# Altium schematic sheet output_stage.SchDoc
size 431 x 279 mm; Author: Pawel Bukowiec; Organization: ORGANIZATION; Address1: ADDRESS 1; Address2: ADDRESS 2; Address3: ADDRESS 3; Address4: ADDRESS 4; Revision: 1; SheetNumber: 5; SheetTotal: 5; ENG_APP_DATE: --/--/--; DSN_APP_DATE: --/--/--; CHK_APP_DATE: --/--/--; SPICEModelCacheNCNDFIAY: <root> / <DocumentId>NCNDFIAY</DocumentId> / <CacheFrame Number="0"> / <Model Name="irfz24n" Kind="CKT"> / <Text>.SUBCKT irfz24n 1 2 3 / ************************************** / *      Model Generated by MODPEX     * / *Copyright(c) Symmetry Design Systems* / *         All Rights Reserved        * / *    UNPUBLISHED LICENSED SOFTWARE   * / *   Contains Proprietary Information * / *      Which is The Property of      * / *     SYMMETRY OR ITS LICENSORS      * / *Commercial Use or Resale Restricted * / *   by Symmetry License Agreement    * / ************************************** / * Model generated on Apr 24, 96 / * Model format: SPICE3 / * Symmetry POWER MOS Model (Version 1.0) / * External Node Designations / * Node 1 -&gt; Drain / * Node 2 -&gt; Gate / * Node 3 -&gt; Source / M1 9 7 8 8 MM L=100u W=100u / * Default values used in MM: / * The voltage-dependent capacitances are / * not included. Other default values are: / *   RS=0 RD=0 LD=0 CBD=0 CBS=0 CGBO=0 / .MODEL MM NMOS LEVEL=1 IS=1e-32 / +VTO=3.6319 LAMBDA=0 KP=8.99346 / +CGSO=3.09714e-06 CGDO=1.6185e-07 / RS 8 3 0.0409355 / D1 3 1 MD / .MODEL MD D IS=1.43387e-10 RS=0.0112766 N=1.28803 BV=55 / +IBV=0.00025 EG=1.2 XTI=2.96465 TT=0 / +CJO=2.96476e-10 VJ=0.50803 M=0.3 FC=0.5 / RDS 3 1 2.2e+06 / RD 9 1 0.0001 / RG 2 7 2.4575 / D2 4 5 MD1 / * Default values used in MD1: / *   RS=0 EG=1.11 XTI=3.0 TT=0 / *   BV=infinite IBV=1mA / .MODEL MD1 D IS=1e-32 N=50 / +CJO=4.37817e-10 VJ=0.5 M=0.578699 FC=1e-08 / D3 0 5 MD2 / * Default values used in MD2: / *   EG=1.11 XTI=3.0 TT=0 CJO=0 / *   BV=infinite IBV=1mA / .MODEL MD2 D IS=1e-10 N=0.4 RS=3e-06 / RL 5 10 1 / FI2 7 9 VFI2 -1 / VFI2 4 0 0 / EV16 10 0 9 7 1 / CAP 11 10 6.81971e-10 / FI1 7 9 VFI1 -1 / VFI1 11 6 0 / RCAP 6 10 1 / D4 0 6 MD3 / * Default values used in MD3: / *   EG=1.11 XTI=3.0 TT=0 CJO=0 / *   RS=0 BV=infinite IBV=1mA / .MODEL MD3 D IS=1e-10 N=0.4 / .ENDS</Text> / </Model> / <Model Name="and2_basic_gen" Kind="CKT"> / <Text>*$ / .SUBCKT AND2_BASIC_GEN A B Y PARAMS: VDD=1 VSS=0 VTHRESH=0.5 / E_ABMGATE    YINT 0 VALUE {{IF(V(A) &gt; {VTHRESH}  &amp; / + V(B) &gt; {VTHRESH},{VDD},{VSS})}} / RINT YINT Y 1 / CINT Y 0 1n / .ENDS AND2_BASIC_GEN</Text> / </Model> / <Model Name="comphys_basic_gen" Kind="CKT"> / <Text>*$ / .SUBCKT COMPHYS_BASIC_GEN INP INM HYS OUT PARAMS: VDD=1 VSS=0 VTHRESH=0.5 / EIN INP1 INM1 INP INM 1 / EHYS INP1 INP2 VALUE { IF( V(1) &gt; {VTHRESH},-V(HYS),0) } / EOUT OUT 0 VALUE { IF( V(INP2)&gt;V(INM1), {VDD} ,{VSS}) } / R1 OUT 1 1 / C1 1 0 5.0n / RINP1 INP1 0 1K / .ENDS COMPHYS_BASIC_GEN</Text> / </Model> / <Model Name="nmos01" Kind="MDL"> / <Text>*$ / ** Wrapper definitions for AA legacy support ** / ****************************** / .model NMOS01 nmos / + vto=2 / + kp=0.55 / + lambda=0.001</Text> / </Model> / <Model Name="buf_basic_gen" Kind="CKT"> / <Text>*$ / .SUBCKT BUF_BASIC_GEN A  Y PARAMS: VDD=1 VSS=0 VTHRESH=0.5 / E_ABMGATE    YINT 0 VALUE {{IF(V(A) &gt; {VTHRESH} , / + {VDD},{VSS})}} / RINT YINT Y 1 / CINT Y 0 1n / .ENDS BUF_BASIC_GEN</Text> / </Model> / <Model Name="falling_delay" Kind="CKT"> / <Text>****************************** / *$ / .subckt falling_delay in out params: delay=100n vdd=1 vss=0 vthresh=0.5 / x_u1         int out buf_basic_gen params: vdd={vdd} vss={vss} vthresh= / + {vthresh} / r_r1         in int  {delay/(0.693 * 1e-9)} / c_c1         0 int  1n / d_d1         in int dd / .model dd d / + is=1e-015 / + n=1 / + tt=1e-011 / .ends falling_delay</Text> / <Dependency>0\buf_basic_gen</Dependency> / </Model> / <Model Name="nsw_ps" Kind="CKT"> / <Text>*$ / .SUBCKT NSW_PS D G S PARAMS: RONval=10k VTHval=0.7 VCHARval=0.01 CGval=0.01pF CDval=0.01pF CSval=0.01pf / RDDUM D 0 1e11 / RSDUM S 0 1e11 / RGDUM G 0 1e11 / CG G D {CGval} / CD D S {CDval} / CS G S {CSval} / ***EEXP F1 0 VALUE={LIMIT(((V(G,S)-VTHval)/VCHARval),-80,80)} / Etest test 0 VALUE={IF(V(D) &gt; V(S), V(G,S), V(G,D))} / GOUT D S VALUE={V(D,S)/(RONval*(1+EXP(-LIMIT(((V(test)-VTHval)/VCHARval),-80,80))))} / .ENDS NSW_PS</Text> / </Model> / <Model Name="psw_ps" Kind="CKT"> / <Text>*$ / .SUBCKT PSW_PS D G S PARAMS: RONval=10k VTHval=0.7 VCHARval=0.01 CGval=0.01pF CDval=0.01pF / RDDUM D 0 1e11 / RSDUM S 0 1e11 / RGDUM G 0 1e11 / CG G D {CGval} / CD D S {CDval} / Etest test 0 VALUE={IF(V(S) &gt; V(D), V(S,G), V(D,G))} / GOUT S D VALUE={V(S,D)/(RONval*(1+EXP(-LIMIT(((V(test)-VTHval)/VCHARval),-80,80))))} / .ENDS PSW_PS</Text> / </Model> / <Model Name="buffer_ps" Kind="CKT"> / <Text>*$ / .SUBCKT BUFFER_PS A Y PARAMS: vhi=1 vlo=0 vthresh=500e-3 tplh=1e-9 tphl=1e-9 tr=1e-9 tf=1e-9 / RA A 0 1e11 / CA A 0 0.01pF / VS VSUP 0 DC 1 / EBUF1 Ypp 0 VALUE={IF(V(A) &gt; ({vthresh}), 1, 0)} / ROUTpp Ypp 0 1e11 / XNSW1 OUTp Ypp 0 NSW_PS PARAMS: RONval={(tplh+1e-15)/(1e-12*0.693)} VTHval=0.5 / XPSW1 OUTp Ypp VSUP PSW_PS PARAMS: RONval={(tphl+1e-15)/(1e-12*0.693)} VTHval=0.5 / CDEL1 OUTp 0 1pF / ETHRESH Yp 0 VALUE={IF(V(OUTp) &gt; 0.5, 1, 0)} / ROUTp Yp 0 1e11 / XNSW2 OUTr Yp 0 NSW_PS PARAMS: RONval={(tf+1e-15)/(1e-12*2.3)} VTHval=0.5 / XPSW2 OUTr Yp VSUP PSW_PS PARAMS: RONval={(tr+1e-15)/(1e-12*2.3)} VTHval=0.5 / CDEL2 OUTr 0 1pF / EOUT OUTf 0 VALUE={V(OUTr)*({vhi} - {vlo})+{vlo}} / RDR OUTf Y  1000 / RO Y 0 1e11 / .ENDS BUFFER_PS</Text> / <Dependency>0\nsw_ps</Dependency> / <Dependency>0\psw_ps</Dependency> / </Model> / <Model Name="pmos01" Kind="MDL"> / <Text>*$ / ****************************** / .model PMOS01 pmos / + vto=-2 / + kp=0.772 / + lambda=0.001</Text> / </Model> / <Model Name="d_d1" Kind="CKT"> / <Text>*$ / ****************************** / .subckt d_d1 1 2 / d1 1 2 dd1 / .model dd1 d / + is=1e-015 / + tt=1e-011 / + rs=0.05 / + n=1 / .ends d_d1</Text> / </Model> / <Model Name="and3_basic_gen" Kind="CKT"> / <Text>*$ / .SUBCKT AND3_BASIC_GEN A B C Y PARAMS: VDD=1 VSS=0 VTHRESH=0.5 / E_ABMGATE    YINT 0 VALUE {{IF(V(A) &gt; {VTHRESH}  &amp; / + V(B) &gt; {VTHRESH} &amp; / + V(C) &gt; {VTHRESH},{VDD},{VSS})}} / RINT YINT Y 1 / CINT Y 0 1n / .ENDS AND3_BASIC_GEN</Text> / </Model> / <Model Name="nand2_basic_gen" Kind="CKT"> / <Text>*$ / .SUBCKT NAND2_BASIC_GEN A B Y PARAMS: VDD=1 VSS=0 VTHRESH=0.5 / E_ABMGATE    YINT 0 VALUE {{IF(V(A) &gt; {VTHRESH}  &amp; / + V(B) &gt; {VTHRESH},{VSS},{VDD})}} / RINT YINT Y 1 / CINT Y 0 1n / .ENDS NAND2_BASIC_GEN</Text> / </Model> / <Model Name="ucc27282" Kind="CKT"> / <Text>* * source UCC27282 / ***************************************************************************** / * (C) Copyright 2018 Texas Instruments Incorporated. All rights reserved. / ***************************************************************************** / ** This model is designed as an aid for customers of Texas Instruments. / ** TI and its licensors and suppliers make no warranties, either expressed / ** or implied, with respect to this model, including the warranties of / ** merchantability or fitness for a particular purpose. The model is / ** provided solely on an "as is" basis. The entire risk as to its quality / ** and performance is with the customer. / ***************************************************************************** / * / * Released by: WEBENCH Design Center, Texas Instruments Inc. / * Part: UCC27282 / * Date: 10/31/2018 / * Model Type: Transient / * Simulator: PSPICE / * Simulator Version: 16.2 / * EVM Order Number: / * EVM Users Guide: SLUUBM2 / * Datasheet: SNVSAQ5 / * Model Version: Final 1.0 / * Release to Web. / **************************************************************** / *$ / .SUBCKT UCC27282 LI HI EN VDD VSS HB  HO HS  LO / E_U1_E2         HO U1_N16706734 VALUE { IF(V(U1_N16706930, 0) &gt; 0.5, -5, 5) } / R_U1_R9         U1_N16707490 U1_N16707354  50 / V_U1_V10         U1_N16706152 0 0.5 / X_U1_U15         EN U1_N16711349 U1_N16711355 U1_N16713299 COMPHYS_BASIC_GEN / +  PARAMS: VDD=1 VSS=0 VTHRESH=0.5 / E_U1_E6         U1_HI_ON VSS U1_N16708422 VSS 1 / E_U1_E1         U1_N16707534 U1_HOH VALUE { IF(V(U1_HI_ON, 0) &gt; 0.5, 5, -5) } / X_U1_U16         U1_N16712773 U1_N16713299 U1_N16707820 AND2_BASIC_GEN PARAMS: / +  VDD=1 VSS=0 VTHRESH=.5 / X_U1_U4         U1_N16706536 U1_UVLOHI U1_N16708416 AND2_BASIC_GEN PARAMS: / +  VDD=1 VSS=0 VTHRESH=.5 / C_U1_C6         HO U1_N16706748  7.5p / X_U1_U5         HI U1_N16706446 U1_N16706474 U1_N16706240 COMPHYS_BASIC_GEN / +  PARAMS: VDD=1 VSS=0 VTHRESH=0.5 / E_U1_E7         U1_N16708078 VSS HB HS 1 / M_U1_M1         U1_N16707574 U1_N16707548 U1_HOH U1_HOH NMOS01 / C_U1_C7         U1_N16707366 U1_N16707354  12.5p / R_U1_R11         U1_HOH HO  1m / X_U1_U7         U1_HI_ON U1_N16706930 falling_delay PARAMS:  DELAY=1n VDD=1 / +  VSS=0 VTHRESH=0.5 / R_U1_R10         U1_N16707366 VSS  0.02 / V_U1_V3         U1_N16706446 VSS 2.1 / C_U1_C1         U1_N16707548 U1_N16707574  20p / E_U1_E5         U1_LO_ON VSS U1_N16708190 VSS 1 / X_U1_U11         U1_N16708416 U1_N16708422 BUFFER_PS PARAMS: VHI=1 VLO=0 / +  VTHRESH=500E-3 TPLH={Thplh} TPHL={Thphl} TR=1E-9 TF=1E-9 / X_U1_U6         VDD HB d_d1 PARAMS: / ***X_U1_U6         0 0  d_d1 PARAMS: / V_U1_V4         U1_N16706474 0 1 / C_U1_C3         U1_HOH U1_N16707548  5p / C_U1_C8         LO U1_N16707354  7.5p / R_U1_R4         HB U1_N16707574  0.02 / X_U1_U17         U1_N16706240 U1_LOCK U1_N16707820 U1_UVLOHI AND3_BASIC_GEN / +  PARAMS: VDD=1 VSS=0 VTHRESH=500E-3 / X_U1_U12         U1_UVLOLOW U1_N16708190 BUFFER_PS PARAMS: VHI=1 VLO=0 / +  VTHRESH=500E-3 TPLH={Tlplh} TPHL={Tlphl} TR=1E-9 TF=1E-9 / E_U1_E4         U1_N16707138 U1_LOH VALUE { IF(V(U1_LO_ON, 0) &gt; 0.5, 5, -5) } / R_U1_R7         U1_N16707138 U1_N16707192  50 / R_U1_R12         U1_LOH LO  1m / M_U1_M4         U1_N16707366 U1_N16707354 LO LO PMOS01 / M_U1_M2         U1_N16706782 U1_N16706748 HO HO PMOS01 / R_U1_R2         VSS HI  250k / V_U1_V11         U1_N16711349 VSS 1.8 / R_U1_R5         U1_N16706734 U1_N16706748  50 / X_U1_U13         HB U1_N16708226 U1_N16708274 U1_N16706536 COMPHYS_BASIC_GEN / +  PARAMS: VDD=1 VSS=0 VTHRESH=0.5 / M_U1_M3         U1_N16707204 U1_N16707192 U1_LOH U1_LOH NMOS01 / V_U1_V1         U1_N16706306 VSS 2.1 / X_U1_U9         U1_N16708078 U1_N16707998 U1_N16708046 N16718557 / +  COMPHYS_BASIC_GEN PARAMS: VDD=1 VSS=0 VTHRESH=0.5 / X_U1_U8         U1_LO_ON U1_N16707522 falling_delay PARAMS:  DELAY=1n VDD=1 / +  VSS=0 VTHRESH=0.5 / V_U1_V12         U1_N16711355 0 0.4 / C_U1_C4         U1_N16707192 U1_N16707204  20p / V_U1_V7         U1_N16708226 0 3.7 / E_U1_E3         LO U1_N16707490 VALUE { IF(V(U1_N16707522, 0) &gt; 0.5, -5, 5) } / C_U1_C2         U1_N16706782 U1_N16706748  12.5p / X_U1_U14         VDD U1_N16706124 U1_N16706152 U1_N16712773 COMPHYS_BASIC_GEN / +  PARAMS: VDD=1 VSS=0 VTHRESH=0.5 / V_U1_V2         U1_N16706332 0 1 / V_U1_V5         U1_N16707998 0 3.55 / C_U1_C5         U1_LOH U1_N16707192  5p / R_U1_R13         VSS EN  200k / V_U1_V8         U1_N16708274 0 0.4 / R_U1_R6         U1_N16706782 HS  0.02 / X_U1_U10         LI U1_N16706306 U1_N16706332 U1_N16706526 COMPHYS_BASIC_GEN / +  PARAMS: VDD=1 VSS=0 VTHRESH=0.5 / X_U1_U20         HI LI U1_LOCK NAND2_BASIC_GEN PARAMS: VDD=1 VSS=0 / +  VTHRESH=500E-3 / R_U1_R8         VDD U1_N16707204  0.02 / V_U1_V6         U1_N16708046 0 0.1 / R_U1_R1         VSS LI  250k / V_U1_V9         U1_N16706124 VSS 5 / R_U1_R3         U1_N16707534 U1_N16707548  50 / X_U1_U18         U1_N16707820 U1_LOCK U1_N16706526 U1_UVLOLOW AND3_BASIC_GEN / +  PARAMS: VDD=1 VSS=0 VTHRESH=500E-3 / .PARAM  thplh=10n tlphl=8.2n thphl=8n tlplh=10.5n / .ends UCC27282</Text> / <Dependency>0\and2_basic_gen</Dependency> / <Dependency>0\comphys_basic_gen</Dependency> / <Dependency>0\nmos01</Dependency> / <Dependency>0\falling_delay</Dependency> / <Dependency>0\buffer_ps</Dependency> / <Dependency>0\pmos01</Dependency> / <Dependency>0\d_d1</Dependency> / <Dependency>0\and3_basic_gen</Dependency> / <Dependency>0\nand2_basic_gen</Dependency> / </Model> / </CacheFrame> / </root>
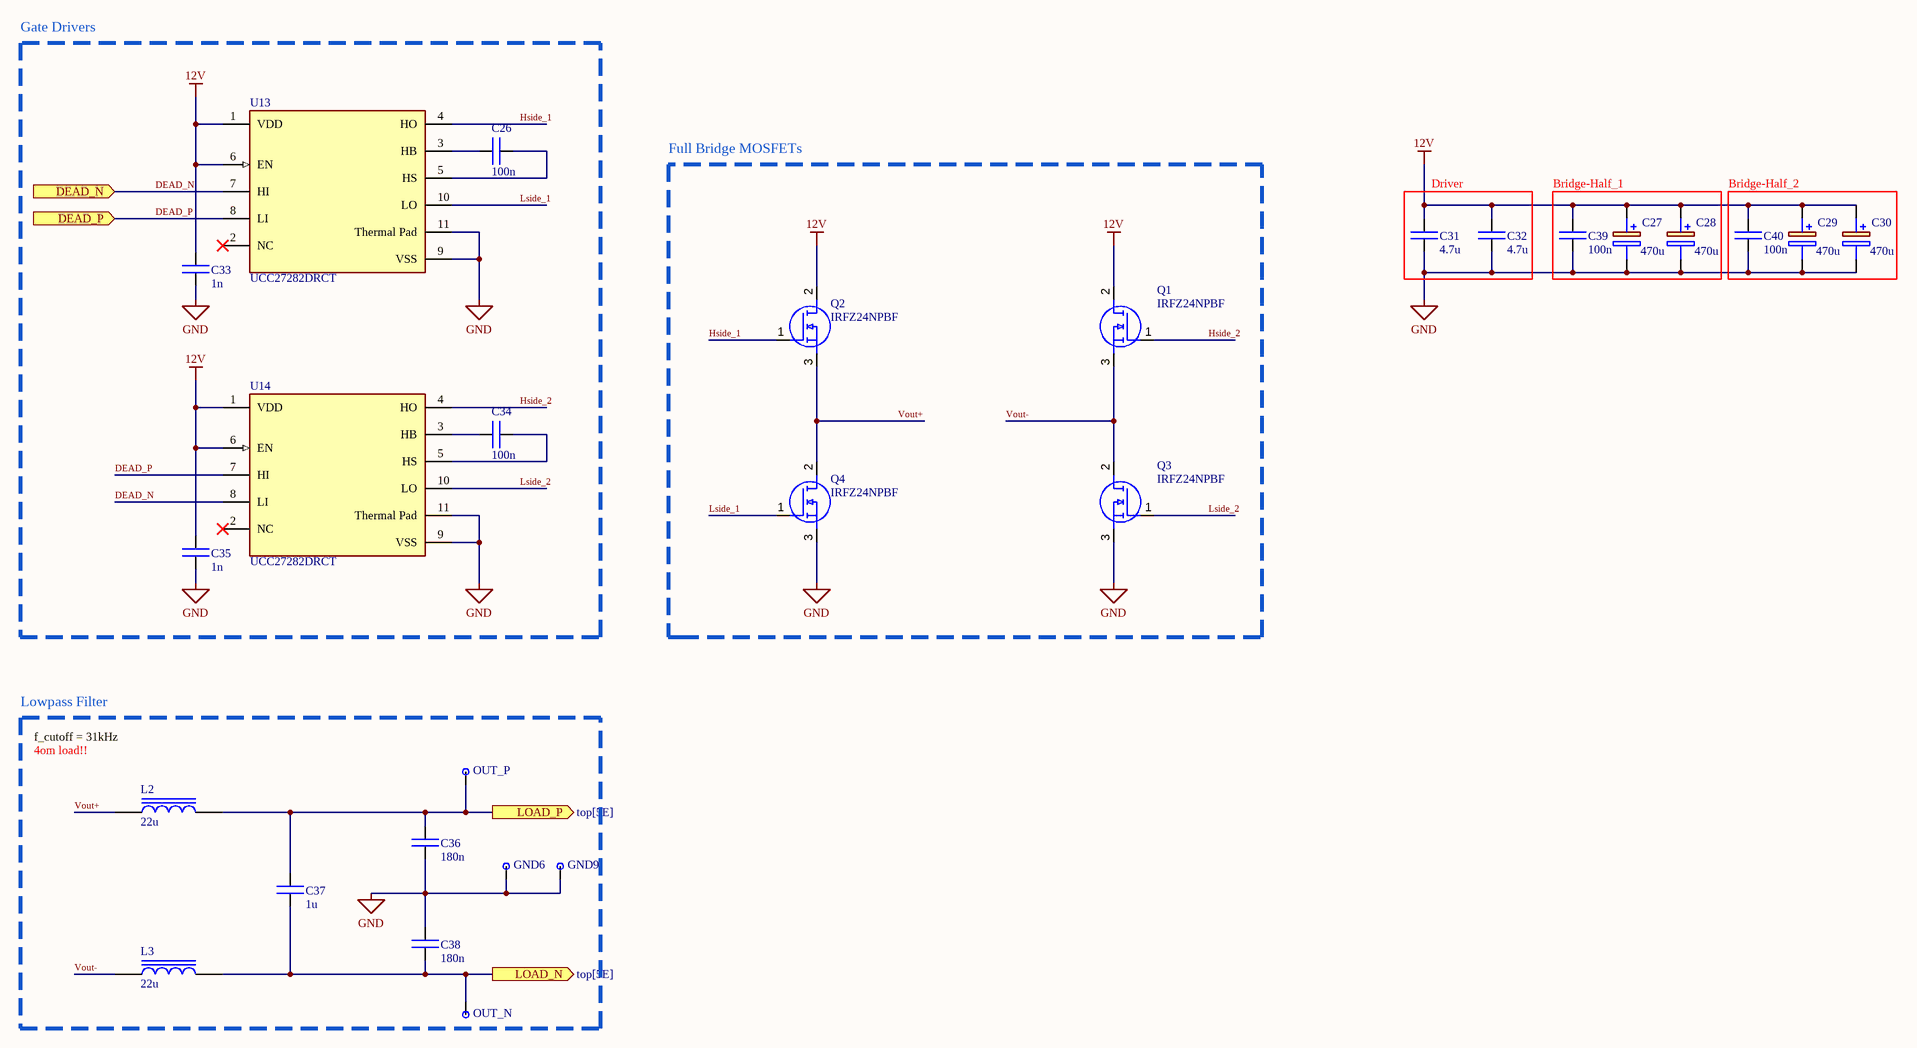
[diagram p0: output_stage.SchDoc]

## Parts
C26  100n  [CAP_IPC_0805_133A]
C27  470u  [EEEFK1V331P]
C28  value 470u  [EEEFK1V331P]  (hidden comment: EEEFK1E471P)
C29  value 470u  [EEEFK1V331P]  (hidden comment: EEEFK1E471P)
C30  value 470u  [EEEFK1V331P]  (hidden comment: EEEFK1E471P)
C31  4.7u  [CAP_IPC_0805_133A]
C32  4.7u  [CAP_IPC_0805_133A]
C33  1n  [CAP_IPC_0805_133A]
C34  100n  [CAP_IPC_0805_133A]
C35  1n  [CAP_IPC_0805_133A]
C36  180n  [CAP_IPC_0805_133A]
C37  1u  [CAP_IPC_0805_133A]
C38  180n  [CAP_IPC_0805_133A]
C39  100n  [CAP_IPC_0805_133A]
C40  100n  [CAP_IPC_0805_133A]
GND6  TestPoint  [TestPoint_SMT]  (value not drawn)
GND9  TestPoint  [TestPoint_SMT]  (value not drawn)
L2  22u  [SRR1208-220ML]
L3  22u  [SRR1208-220ML]
OUT_N  TestPoint  [TestPoint_SMT]  (value not drawn)
OUT_P  TestPoint  [TestPoint_SMT]  (value not drawn)
Q1  IRFZ24NPBF  [IRFZ24NPBF]
Q2  IRFZ24NPBF  [IRFZ24NPBF]
Q3  IRFZ24NPBF  [IRFZ24NPBF]
Q4  IRFZ24NPBF  [IRFZ24NPBF]
U13  UCC27282DRCT  [UCC27282]
U14  UCC27282DRCT  [UCC27282]

## Blocks framed on the sheet
Gate Drivers: C26 C33-C35 U13 U14
Full Bridge MOSFETs: Q1-Q4
Driver: C31 C32
Bridge-Half_1: C27 C28 C39
Bridge-Half_2: C29 C30 C40
Lowpass Filter: C36-C38 GND6 GND9 L2 L3 OUT_N OUT_P

## Ports
DEAD_N (in, see top[6E], control_logic[2C]), DEAD_P (in, see top[6E], control_logic[2C]), LOAD_N (out, see top[5E]), LOAD_P (out, see top[5E])

## Nets
12V: C27.1(+) C28.1(+) C29.1(+) C30.1(+) C31.1 C32.1 C33.2 C35.2 C39.1 C40.1 Q1.2(D) Q2.2(D) U13.1(VDD) U13.6(EN) U14.1(VDD) U14.6(EN)
GND: C27.2(-) C28.2(-) C29.2(-) C30.2(-) C31.2 C32.2 C33.1 C35.1 C36.2 C38.1 C39.2 C40.2 GND6.1 GND9.1 Q3.3(S) Q4.3(S) U13.9(VSS) U13.11(Thermal_Pad) U14.9(VSS) U14.11(Thermal_Pad)
DEAD_N: U13.7(HI) U14.8(LI) ; port DEAD_N
DEAD_P: U13.8(LI) U14.7(HI) ; port DEAD_P
Hside_1: Q2.1(G) U13.4(HO)
Hside_2: Q1.1(G) U14.4(HO)
LOAD_N: C37.2 C38.2 L3.2 OUT_N.1 ; port LOAD_N
LOAD_P: C36.1 C37.1 L2.2 OUT_P.1 ; port LOAD_P
Lside_1: Q4.1(G) U13.10(LO)
Lside_2: Q3.1(G) U14.10(LO)
Vout+: L2.1 Q2.3(S) Q4.2(D)
Vout-: L3.1 Q1.3(S) Q3.2(D)
NetC26_1: C26.1 U13.3(HB)
NetC26_2: C26.2 U13.5(HS)
NetC34_1: C34.1 U14.3(HB)
NetC34_2: C34.2 U14.5(HS)

Not connected (* = marked no-connect by the designer): U13 2(NC)*; U14 2(NC)*

## Notes on the sheet
- f_cutoff = 31kHz
- 4om load!!
- Project Name:
- Company Confidential / Not for distribution!
- Document Name:
- Designer Name:
- Date/Time:
- Revision:

## Library data of the parts
C26 C34 = Capacitor: Dielectric: X7R; Volatge: 50; Manufacturer: *; Part Number: *; Value: 100n
C27-C30 = EEEFK1E471P: Capacitor Polarised; Manufacturer_Name: Panasonic; Datasheet Link: http://industrial.panasonic.com/cdbs/www-data/pdf/RDE0000/ABA0000C1181.pdf; Manufacturer_Part_Number: EEEFK1E471P; Mouser Part Number: 667-EEE-FK1E471P; Mouser Price/Stock: http://www.mouser.com/Search/ProductDetail.aspx?qs=qE6bgDGEOCvvsolWS4cebg%3d%3d; Arrow Part Number: EEEFK1E471P; Arrow Price/Stock: https://www.arrow.com/en/products/eee-fk1e471p/panasonic
  C27: Value: 470u
C31 C32 C39 C40 = Capacitor: Manufacturer: *; Part Number: *
  C31 C32: Value: 4.7u
  C39 C40: Value: 100n
C33 C35 = Capacitor: Dielectric: X7R; Volatge: 25; Manufacturer: *; Part Number: *; Value: 1n
C36-C38 = Capacitor: Dielectric: X7R; Voltage: 50; Manufacturer: *; Part Number: *
  C36 C38: Value: 180n
  C37: Value: 1u
GND6 GND9 OUT_N OUT_P = TestPoint: Test Point
L2 L3 = SRR1208-220ML_inductor: Inductor SMD; 22uH; Ioperation: 3.5A; R: 43mΩ; ±20%; Isat: 4A; Manufacturer_Name: BOURNS; TME Electronic Components Part Number: *; TME Electronic Components Price/Stock: *; Manufacturer_Part_Number: SRR1208-220ML; Value: 22u
Q1-Q4 = IRFZ24NPBF: HEXFET POWER MOSFET N-CHANNEL; Manufacturer_Name: Infineon; Geometry.Height: 4.69mm; TME Electronic Components Part Number: *; TME Electronic Components Price/Stock: *; Manufacturer_Part_Number: IRFZ24NPBF; Datasheet Link: *
U13 U14 = UCC27282DRCT: IC GATE DRVR HALF-BRIDGE 10VSON; RoHS Compliant: Yes